# Altium schematic sheet C8051F040.SchDoc
size A4
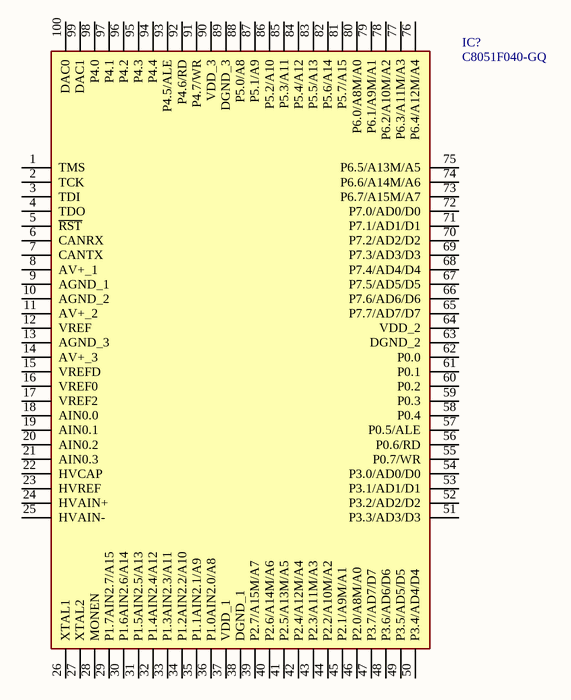
[diagram p0: C8051F040.SchDoc]

## Parts
IC?  C8051F040-GQ  [QFP50P1600X1600X120-100N]

## Nets

Not connected (* = marked no-connect by the designer): IC? 1(TMS) 2(TCK) 3(TDI) 4(TDO) 5(~{RST}) 6(CANRX) 7(CANTX) 8(AV+_1) 9(AGND_1) 10(AGND_2) 11(AV+_2) 12(VREF) 13(AGND_3) 14(AV+_3) 15(VREFD) 16(VREF0) 17(VREF2) 18(AIN0.0) 19(AIN0.1) 20(AIN0.2) 21(AIN0.3) 22(HVCAP) 23(HVREF) 24(HVAIN+) 25(HVAIN-) 26(XTAL1) 27(XTAL2) 28(MONEN) 29(P1.7AIN2.7/A15) 30(P1.6AIN2.6/A14) 31(P1.5AIN2.5/A13) 32(P1.4AIN2.4/A12) 33(P1.3AIN2.3/A11) 34(P1.2AIN2.2/A10) 35(P1.1AIN2.1/A9) 36(P1.0AIN2.0/A8) 37(VDD_1) 38(DGND_1) 39(P2.7/A15M/A7) 40(P2.6/A14M/A6) 41(P2.5/A13M/A5) 42(P2.4/A12M/A4) 43(P2.3/A11M/A3) 44(P2.2/A10M/A2) 45(P2.1/A9M/A1) 46(P2.0/A8M/A0) 47(P3.7/AD7/D7) 48(P3.6/AD6/D6) 49(P3.5/AD5/D5) 50(P3.4/AD4/D4) 51(P3.3/AD3/D3) 52(P3.2/AD2/D2) 53(P3.1/AD1/D1) 54(P3.0/AD0/D0) 55(P0.7/WR) 56(P0.6/RD) 57(P0.5/ALE) 58(P0.4) 59(P0.3) 60(P0.2) 61(P0.1) 62(P0.0) 63(DGND_2) 64(VDD_2) 65(P7.7/AD7/D7) 66(P7.6/AD6/D6) 67(P7.5/AD5/D5) 68(P7.4/AD4/D4) 69(P7.3/AD3/D3) 70(P7.2/AD2/D2) 71(P7.1/AD1/D1) 72(P7.0/AD0/D0) 73(P6.7/A15M/A7) 74(P6.6/A14M/A6) 75(P6.5/A13M/A5) 76(P6.4/A12M/A4) 77(P6.3/A11M/A3) 78(P6.2/A10M/A2) 79(P6.1/A9M/A1) 80(P6.0/A8M/A0) 81(P5.7/A15) 82(P5.6/A14) 83(P5.5/A13) 84(P5.4/A12) 85(P5.3/A11) 86(P5.2/A10) 87(P5.1/A9) 88(P5.0/A8) 89(DGND_3) 90(VDD_3) 91(P4.7/WR) 92(P4.6/RD) 93(P4.5/ALE) 94(P4.4) 95(P4.3) 96(P4.2) 97(P4.1) 98(P4.0) 99(DAC1) 100(DAC0)

## Library data of the parts
IC? = C8051F040-GQ: Integrated Circuit; Manufacturer_Name: Silicon Labs; Datasheet Link: https://www.silabs.com/documents/public/data-sheets/C8051F04x.pdf; Height: 1.2mm; Manufacturer_Part_Number: C8051F040-GQ; Arrow Part Number: C8051F040-GQ; Arrow Price/Stock: https://www.arrow.com/en/products/c8051f040-gq/silicon-labs; Mouser Part Number: 634-C8051F040-GQ; Mouser Price/Stock: https://www.mouser.co.uk/ProductDetail/Silicon-Labs/C8051F040-GQ?qs=ir69HB%252BHlEtuP9PDWDnwkQ%3D%3D